# EAGLE schematic 612_jetracer_display (EAGLE 9.6.2)
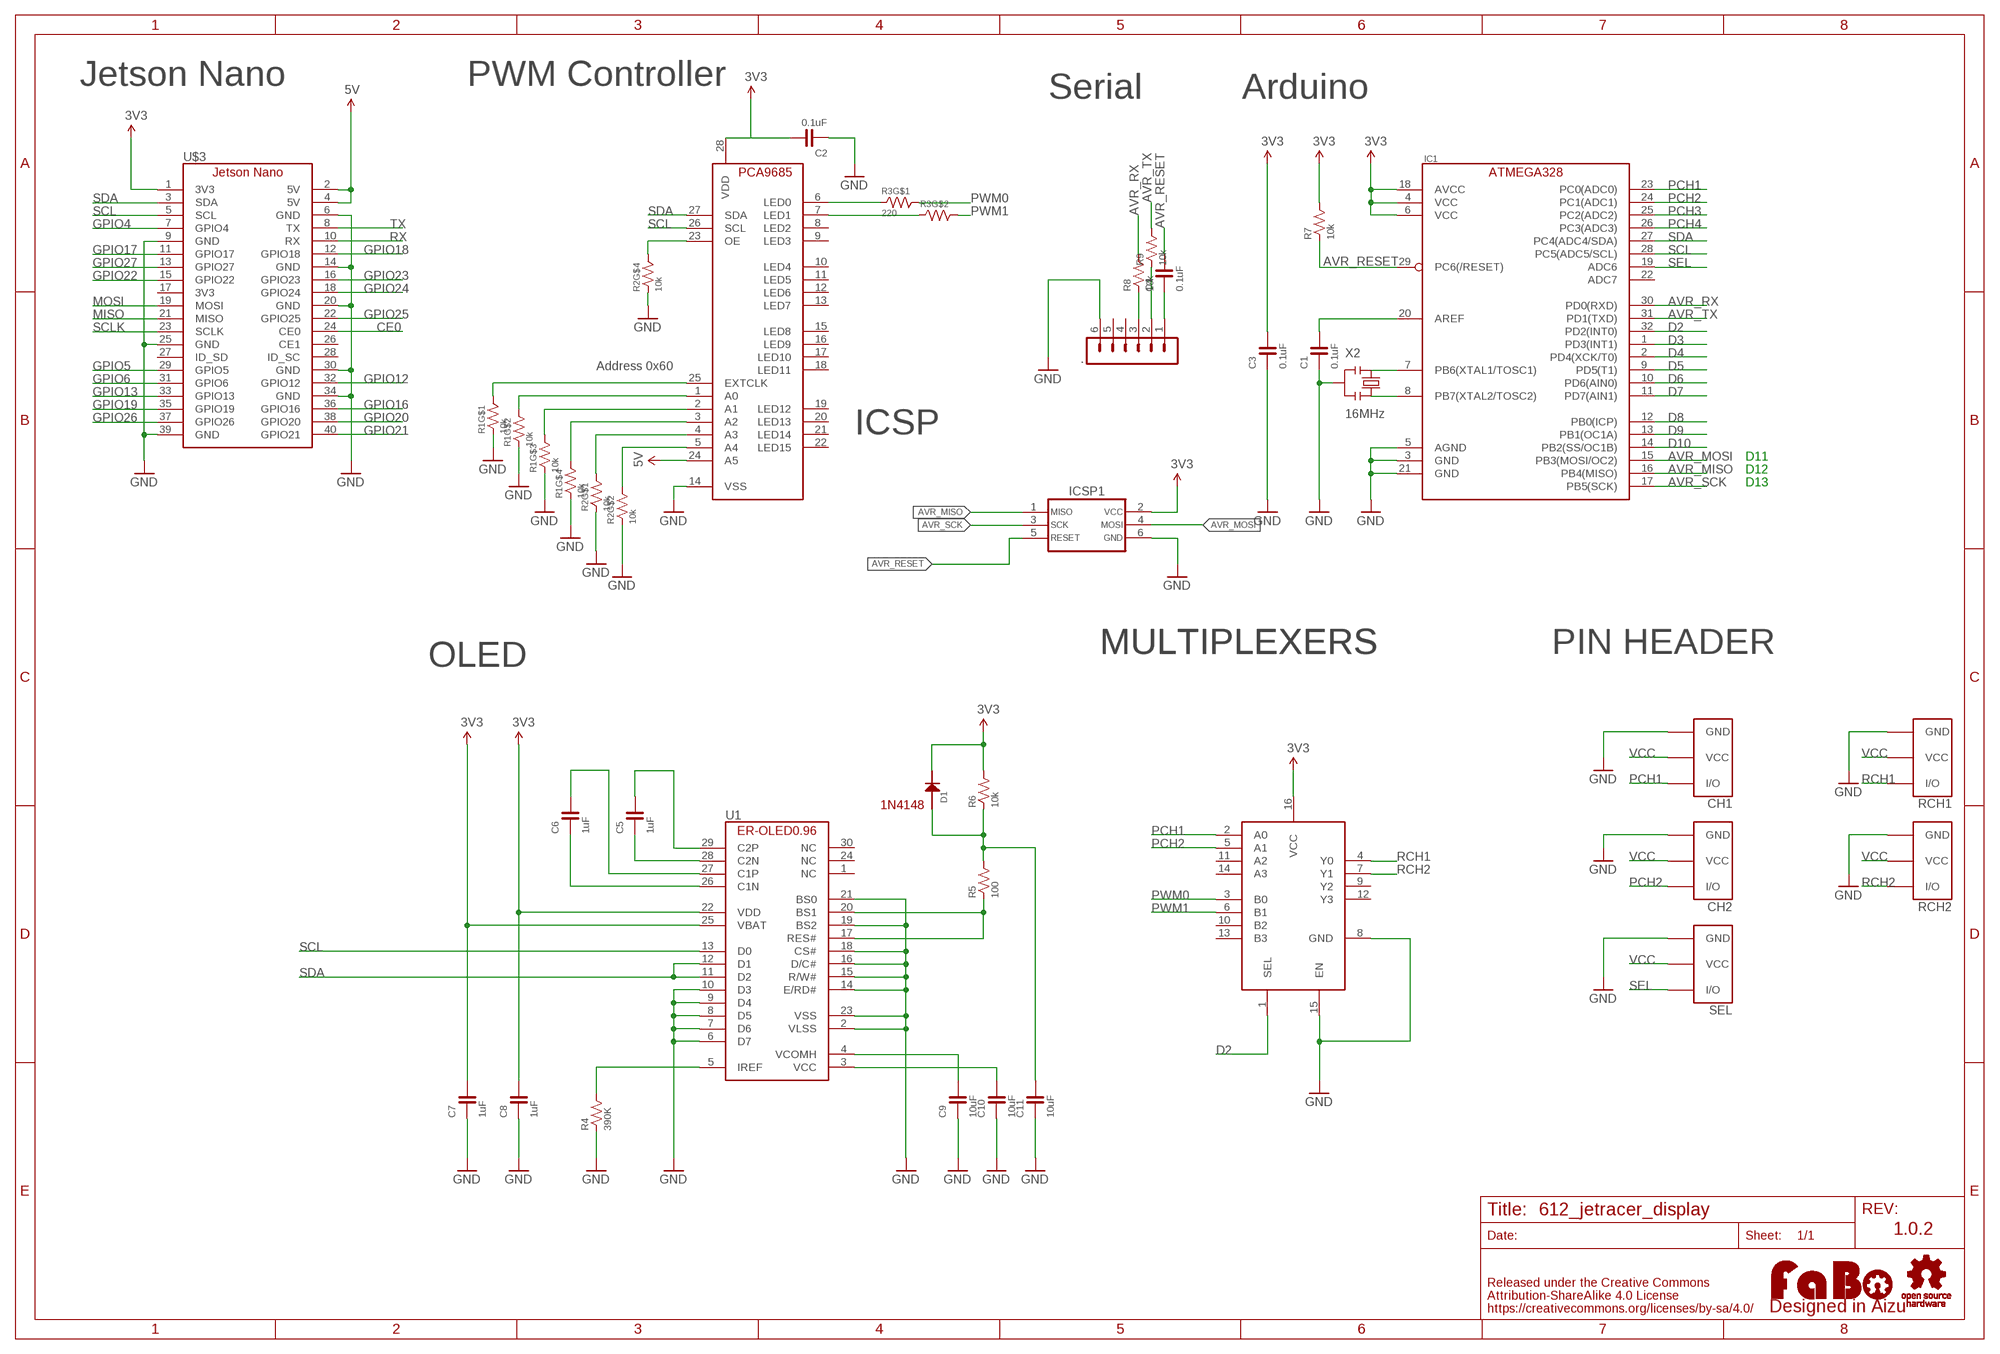
[diagram p0: schematic, sheet 1]

## Parts
.  MA06-1  [MA06-1]
C1  0.1uF  CAPACITOR-0603  [0603]
C2  0.1uF  CAPACITOR-0603  [0603]
C3  0.1uF  CAPACITOR-0603  [0603]
C4  0.1uF  CAPACITOR-0603  [0603]
C5  1uF  CAPACITOR-0603-BOTTOM  [0603-BOTTOM]
C6  1uF  CAPACITOR-0603-BOTTOM  [0603-BOTTOM]
C7  1uF  CAPACITOR-0603-BOTTOM  [0603-BOTTOM]
C8  1uF  CAPACITOR-0603-BOTTOM  [0603-BOTTOM]
C9  10uF  CAPACITOR-0603-BOTTOM  [0603-BOTTOM]
C10  10uF  CAPACITOR-0603-BOTTOM  [0603-BOTTOM]
C11  10uF  CAPACITOR-0603-BOTTOM  [0603-BOTTOM]
CH1  FABO_BRICK_3PIN-HEADER  [FABO_BRICK_3PIN_HEADER]
CH2  FABO_BRICK_3PIN-HEADER  [FABO_BRICK_3PIN_HEADER]
D1  1N4148  [1N4148W]
IC1  ATMEGA328P-AU  [TQFP-32]
IC3  MULTIPLEXERSMC74HC157A  [TSSOP-16]
ICSP1  ICSP_AVR-TC_NOHOLE  [TC2030]
R1  10k  RESISTOR_ARRAY  [EXBV8V]
R2  10k  RESISTOR_ARRAY  [EXBV8V]
R3  220  RESISTOR_ARRAY  [EXBV8V]
R4  390K  RESISTOR-0603-BOTTOM  [0603-BOTTOM]
R5  100  RESISTOR-0603-BOTTOM  [0603-BOTTOM]
R6  10k  RESISTOR-0603-BOTTOM  [0603-BOTTOM]
R7  10k  RESISTOR-0603  [0603]
R8  10k  RESISTOR-0603  [0603]
R9  10k  RESISTOR-0603  [0603]
RCH1  FABO_BRICK_3PIN-HEADER  [FABO_BRICK_3PIN_HEADER]
RCH2  FABO_BRICK_3PIN-HEADER  [FABO_BRICK_3PIN_HEADER]
SEL  FABO_BRICK_3PIN-HEADER  [FABO_BRICK_3PIN_HEADER]
U1  ER-OLED0.96-1ER-CON30HT-1  [ER-CON30HT-1]
U$2  LOGO_OSHW-M_BOTTOM  [LOGO_OSHW_M_BOTTOM]
U$3  JETSON_NANO  [JETSON_NANO]
U$5  LOGO_FABO-M  [LOGO_FABO_MS]
U$9  PCA9685  [PCA9685]
X2  16MHz  RESONATOR  [CSTNE_V_C]

## Nets
3V3: C2.2 C3.2 C7.2 D1.CATHODE IC1.4(VCC) IC1.6(VCC) IC1.18(AVCC) IC3.16(VCC) ICSP1.2 R6.2 R7.2 U1.25(VBAT) U$3.1(3V3) U$9.28(VDD)
5V: U$3.2(5V) U$3.4(5V) U$9.24(A5)
AVR_MISO: IC1.16(PB4(MISO)) ICSP1.1
AVR_MOSI: IC1.15(PB3(MOSI/OC2)) ICSP1.4
AVR_RESET: C4.2 IC1.29(PC6(/RESET)) ICSP1.5 R7.1
AVR_RX: IC1.30(PD0(RXD)) R8.2
AVR_SCK: IC1.17(PB5(SCK)) ICSP1.3
AVR_TX: IC1.31(PD1(TXD)) R9.2
CE0: U$3.24(CE0)
D2: IC1.32(PD2(INT0)) IC3.1(SEL)
D3: IC1.1(PD3(INT1))
D4: IC1.2(PD4(XCK/T0))
D5: IC1.9(PD5(T1))
D6: IC1.10(PD6(AIN0))
D7: IC1.11(PD7(AIN1))
D8: IC1.12(PB0(ICP))
D9: IC1.13(PB1(OC1A))
D10: IC1.14(PB2(SS/OC1B))
GND: ..6 C1.1 C2.1 C3.1 C7.1 C8.1 C9.1 C10.1 C11.1 CH1.GND CH2.GND IC1.3(GND) IC1.5(AGND) IC1.21(GND) IC3.8(GND) IC3.15(EN) ICSP1.6 R1.1 R1.2 R1.3 R1.4 R2.1 R2.2 R2.4 R4.1 RCH1.GND RCH2.GND SEL.GND U1.2(VLSS) U1.6(D7) U1.7(D6) U1.8(D5) U1.9(D4) U1.10(D3) U1.14(E/RD#) U1.15(R/W#) U1.16(D/C#) U1.18(CS#) U1.19(BS2) U1.21(BS0) U1.23(VSS) U$3.6(GND) U$3.9(GND) U$3.14(GND) U$3.20(GND) U$3.25(GND) U$3.30(GND) U$3.34(GND) U$3.39(GND) U$9.14(VSS) X2.2
GPIO4: U$3.7(GPIO4)
GPIO5: U$3.29(GPIO5)
GPIO6: U$3.31(GPIO6)
GPIO12: U$3.32(GPIO12)
GPIO13: U$3.33(GPIO13)
GPIO16: U$3.36(GPIO16)
GPIO17: U$3.11(GPIO17)
GPIO18: U$3.12(GPIO18)
GPIO19: U$3.35(GPIO19)
GPIO20: U$3.38(GPIO20)
GPIO21: U$3.40(GPIO21)
GPIO22: U$3.15(GPIO22)
GPIO23: U$3.16(GPIO23)
GPIO24: U$3.18(GPIO24)
GPIO25: U$3.22(GPIO25)
GPIO26: U$3.37(GPIO26)
GPIO27: U$3.13(GPIO27)
MISO: U$3.21(MISO)
MOSI: U$3.19(MOSI)
N$2: R3.1 U$9.6(LED0)
N$3: R3.2 U$9.7(LED1)
N$4: C1.2 IC1.20(AREF)
N$5: IC1.8(PB7(XTAL2/TOSC2)) X2.3
N$6: ..3 R8.1
N$7: R2.5 U$9.23(OE)
N$8: R1.8 U$9.25(EXTCLK)
N$9: R1.7 U$9.1(A0)
N$10: R1.6 U$9.2(A1)
N$11: R1.5 U$9.3(A2)
N$12: R2.8 U$9.4(A3)
N$13: R2.7 U$9.5(A4)
N$14: C6.2 U1.27(C1P)
N$15: IC1.7(PB6(XTAL1/TOSC1)) X2.1
N$16: C6.1 U1.26(C1N)
N$17: ..2 R9.1
N$18: ..1 C4.1
N$19: C5.1 U1.28(C2N)
N$21: C5.2 U1.29(C2P)
N$23: R4.2 U1.5(IREF)
N$24: C9.2 U1.4(VCOMH)
N$25: C10.2 U1.3(VCC)
N$26: R5.1 U1.17(RES#) U1.20(BS1)
N$27: C11.2 D1.ANODE R5.2 R6.1
N$30: C8.2 U1.22(VDD) ; supply symbol labelled 3V3
PCH1: CH1.I/O IC1.23(PC0(ADC0)) IC3.2(A0)
PCH2: CH2.I/O IC1.24(PC1(ADC1)) IC3.5(A1)
PCH3: IC1.25(PC2(ADC2))
PCH4: IC1.26(PC3(ADC3))
PWM0: IC3.3(B0) R3.8
PWM1: IC3.6(B1) R3.7
RCH1: IC3.4(Y0) RCH1.I/O
RCH2: IC3.7(Y1) RCH2.I/O
RX: U$3.10(RX)
SCL: IC1.28(PC5(ADC5/SCL)) U1.13(D0) U$3.5(SCL) U$9.26(SCL)
SCLK: U$3.23(SCLK)
SDA: IC1.27(PC4(ADC4/SDA)) U1.11(D2) U1.12(D1) U$3.3(SDA) U$9.27(SDA)
SEL: IC1.19(ADC6) SEL.I/O
TX: U$3.8(TX)
VCC: CH1.VCC CH2.VCC RCH1.VCC RCH2.VCC SEL.VCC
Unconnected: ..4 ..5 IC1.22(ADC7) IC3.9(Y2) IC3.10(B2) IC3.11(A2) IC3.12(Y3) IC3.13(B3) IC3.14(A3) R2.3 R2.6 R3.3 R3.4 R3.5 R3.6 U1.1(NC) U1.24(NC) U1.30(NC) U$3.17(3V3) U$3.26(CE1) U$3.27(ID_SD) U$3.28(ID_SC) U$9.8(LED2) U$9.9(LED3) U$9.10(LED4) U$9.11(LED5) U$9.12(LED6) U$9.13(LED7) U$9.15(LED8) U$9.16(LED9) U$9.17(LED10) U$9.18(LED11) U$9.19(LED12) U$9.20(LED13) U$9.21(LED14) U$9.22(LED15)

## Notes on the sheet
- Jetson Nano | PWM Controller
- Serial | Arduino
- Address 0x60
- ICSP
- D11
- D12
- D13
- MULTIPLEXERS | MULTIPLEXERS | PIN HEADER
- OLED
- 1N4148
- 1.0.2

## Library data of the parts
. = con-lstb:MA06-1: PIN HEADER; OC_FARNELL: unknown; OC_NEWARK: unknown
C1-C11 = FaBo-Capacitor:CAPACITOR: CAPACITOR
CH1 CH2 RCH1 RCH2 SEL = FaBo-Template:FABO_BRICK_3PIN: FaBo Brick 3pin
D1 = FaBo-Diode:1N4148
IC1 = component:ATMEGA328
IC3 = FaBo-Multiplexers:MULTIPLEXERS
ICSP1 = component:ICSP_AVR
R1-R3 = component:RESISTOR_ARRAY
R4-R9 = FaBo-Resistors:RESISTOR: RESISTOR
U1 = FaBo-Display:ER-OLED0.96-1
U$2 = FaBo-Logo:LOGO_OSHW
U$3 = FaBo-Boards:JETSON_NANO
U$5 = FaBo-Logo:LOGO_FABO
U$9 = FaBo-Motor:PCA9685
X2 = component:RESONATOR